# EAGLE design input module-v2 (EAGLE 9.6.2)
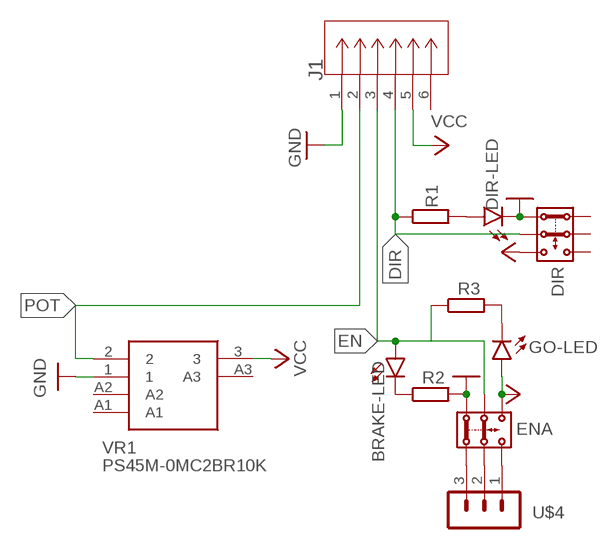
[diagram p0: schematic, sheet 1]

## Parts
BRAKE-LED  LED5MM  [LED5MM]
DIR  DPDT-PUSHBUTTON  [7MM*7MM]
DIR-LED  LED5MM  [LED5MM]
ENA  DPDT-PUSHBUTTON  [7MM*7MM]
GO-LED  LED5MM  [LED5MM]
J1  B6B-PH-K-S(LF)(SN)-JST  [CONN_B6B-PH-K-S_JST]
R1  R-EU_0207/10  [0207/10]
R2  R-EU_0207/10  [0207/10]
R3  R-EU_0207/10  [0207/10]
U$4  MALE-HEADER-3PIN  [MA03-1]
VR1  PS45M-0MC2BR10K  [PS45M0MC2BR10K]

## Nets
DIR: DIR.2 J1.4 R1.1
EN: BRAKE-LED.A ENA.5 J1.3 R3.1
GND: DIR-LED.K(C) DIR.1 ENA.6 J1.1 R2.2 VR1.1
N$4: DIR-LED.A R1.2
N$5: ENA.3 U$4.1
N$6: ENA.2 U$4.2
N$7: ENA.1 U$4.3
N$9: BRAKE-LED.K(C) R2.1
N$10: GO-LED.K(C) R3.2
POT: J1.2 VR1.2
VCC: DIR.3 ENA.4 GO-LED.A J1.5 VR1.3
Unconnected: DIR.4 DIR.5 DIR.6 J1.6 VR1.A1 VR1.A2 VR1.A3

## Library data of the parts
BRAKE-LED DIR-LED GO-LED = led:LED: LED OSRAM: - CHIPLED LG R971, LG N971, LY N971, LG Q971, LY Q971, LO R971, LY R971 LH N974, LH R974 LS Q976, LO Q976, LY Q976 LO Q996 - Hyper CHIPLED LW Q18S LB Q993, LB Q99A, LB R99A - SideLED LS A670, LO A670, LY A670, LG A670, LP A670 LB A673, LV A673, LT A673, LW A673 LH A674 LY A675 LS A676, LA A676, LO A676, LY A676, LW A676 LS A679, LY A679, LG A679 - Hyper Micro SIDELED® LS Y876, LA Y876, LO Y876, LY Y876 LT Y87S - SmartLED LW L88C, LW L88S LB L89C, LB L89S, LG L890 LS L89K, LO L89K, LY L89K LS L896, LA L896, LO L896, LY L896 - TOPLED LS T670, LO T670, LY T670, LG T670, LP T670 LSG T670, LSP T670, LSY T670, LOP T670, LYG T670 LG T671, LOG T671, LSG T671 LB T673, LV T673, LT T673, LW T673 LH T674 LS T676, LA T676, LO T676, LY T676, LB T676, LH T676, LSB T676, LW T676 LB T67C, LV T67C, LT T67C, LS T67K, LO T67K, LY T67K, LW E67C LS E67B, LA E67B, LO E67B, LY E67B, LB E67C, LV E67C, LT E67C LW T67C LS T679, LY T679, LG T679 LS T770, LO T770, LY T770, LG T770, LP T770 LB T773, LV T773, LT T773, LW T773 LH T774 LS E675, LA E675, LY E675, LS T675 LS T776, LA T776, LO T776, LY T776, LB T776 LHGB T686 LT T68C, LB T68C - Hyper Mini TOPLED® LB M676 - Mini TOPLED Santana® LG M470 LS M47K, LO M47K, LY M47K Source: http://www.osram.convergy.de LUXEON: - LUMILED® LXK2-PW12-R00, LXK2-PW12-S00, LXK2-PW14-U00, LXK2-PW14-V00 LXK2-PM12-R00, LXK2-PM12-S00, LXK2-PM14-U00 LXK2-PE12-Q00, LXK2-PE12-R00, LXK2-PE12-S00, LXK2-PE14-T00, LXK2-PE14-U00 LXK2-PB12-K00, LXK2-PB12-L00, LXK2-PB12-M00, LXK2-PB14-N00, LXK2-PB14-P00, LXK2-PB14-Q00 LXK2-PR12-L00, LXK2-PR12-M00, LXK2-PR14-Q00, LXK2-PR14-R00 LXK2-PD12-Q00, LXK2-PD12-R00, LXK2-PD12-S00 LXK2-PH12-R00, LXK2-PH12-S00 LXK2-PL12-P00, LXK2-PL12-Q00, LXK2-PL12-R00 Source: www.luxeon.com KINGBRIGHT: KA-3528ASYC Source: www.kingbright.com
DIR ENA = motorTestRig:DPDT-PUSHBUTTON: 7mm X 7mm DPDT pushbutton switch datasheet <https://cablesandconnectors.com/PIX/al374751p.jpg>
J1 = bidpl:B6B-PH-K-S(LF)(SN)-JST; BUILT_BY: EMA_Cory; COPYRIGHT: Copyright (C) 2018 Accelerated Designs. All rights reserved; DATASHEET: http://www.jst-mfg.com/product/pdf/eng/ePH.pdf; MANUFACTURER_PART_NUMBER: B6B-PH-K-S(LF)(SN); SOURCELIBRARY: Add_to_database_2020-12-08; VENDOR: JST
R1-R3 = resistor:R-EU_: RESISTOR, European symbol
U$4 = motorTestRig:MALE-HEADER-3PIN
VR1 = SamacSys_Parts:PS45M-0MC2BR10K: Slide Potentiometers 10K Ohms 20% SLIDE POTENTIOMETER Source: Datasheet <https://componentsearchengine.com/Datasheets/1/PS45M-0MC2BR10K.pdf>; DESCRIPTION: Slide Potentiometers 10K Ohms 20% SLIDE POTENTIOMETER; HEIGHT: 23mm; MANUFACTURER_NAME: BI Technologies; MANUFACTURER_PART_NUMBER: PS45M-0MC2BR10K; MOUSER_PART_NUMBER: 858-PS45M0MC2BR10K; MOUSER_PRICE-STOCK: https://www.mouser.com/Search/Refine.aspx?Keyword=858-PS45M0MC2BR10K

## Board
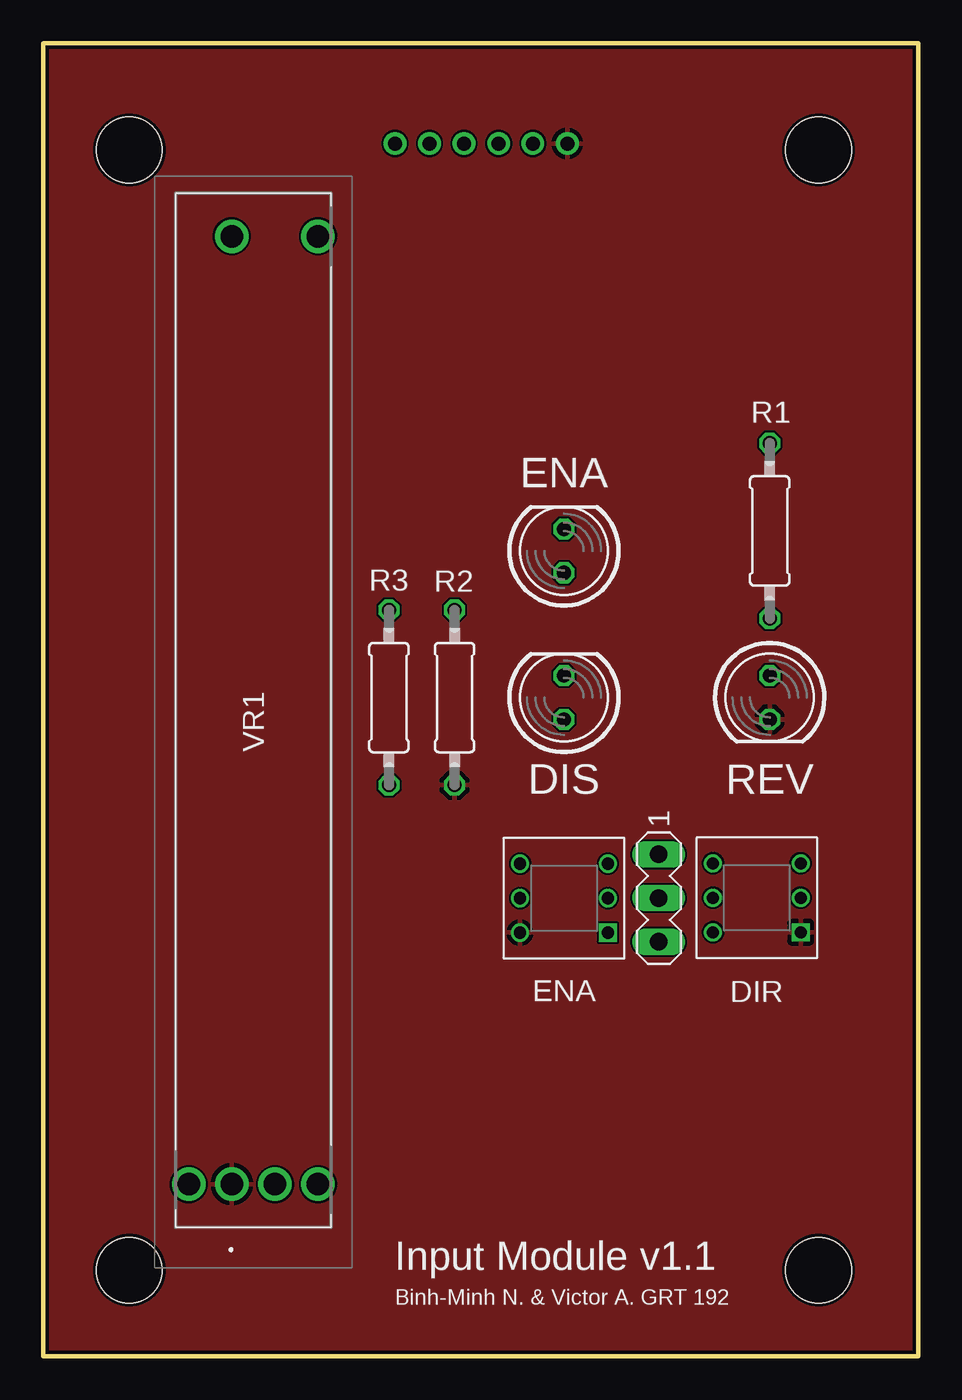
[diagram p1: board, top side]
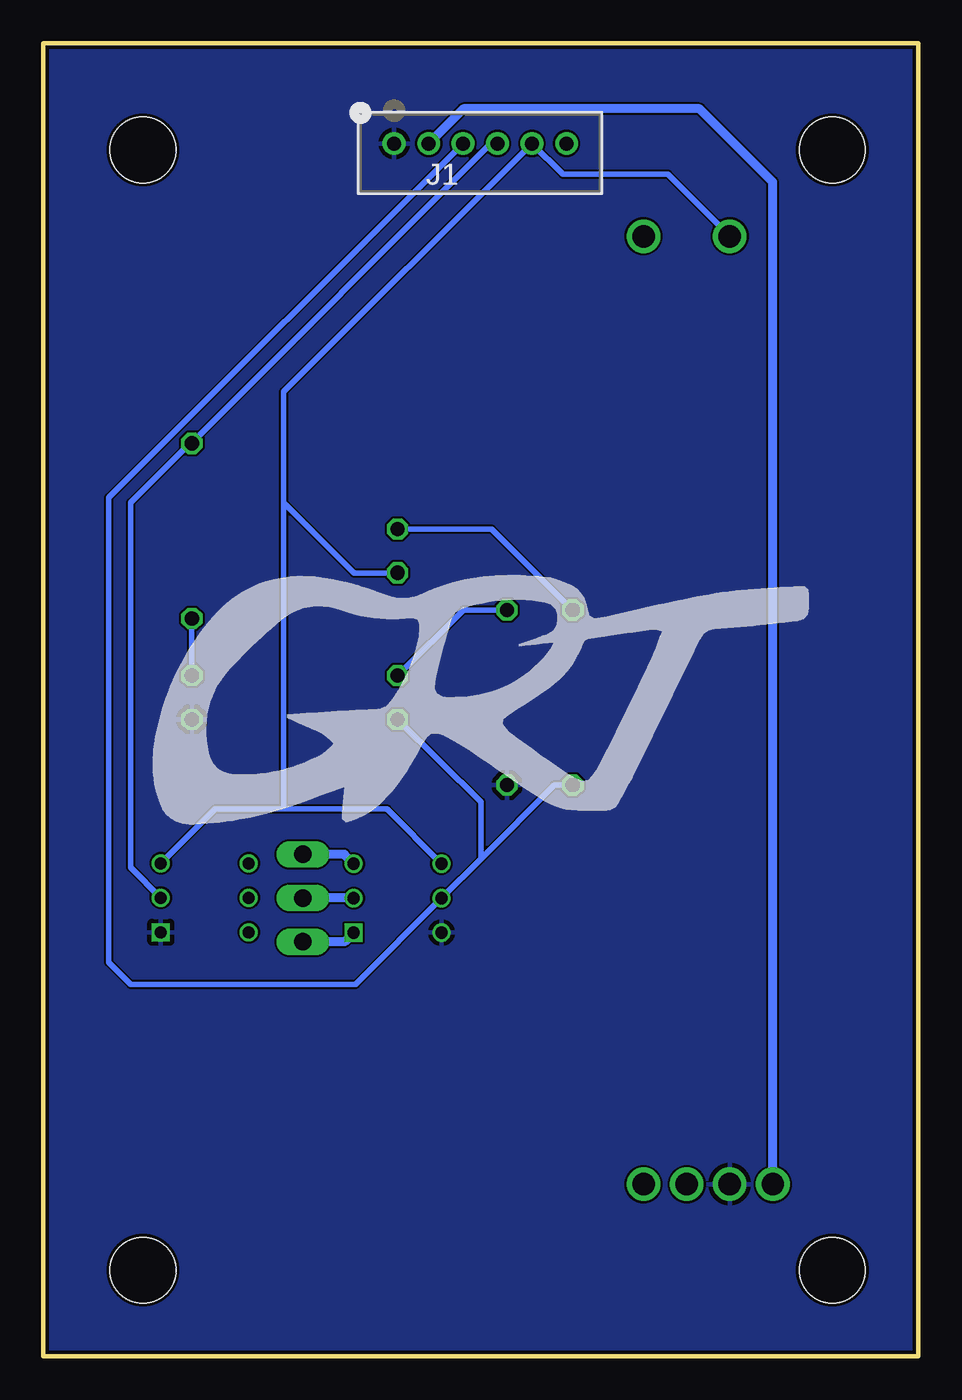
[diagram p2: board, bottom side, seen from below]

Size 50.8 x 76.2 mm. Coordinates in mm from the lower left corner, seen from the top.
Outline: 0,0 50.8,0 50.8,76.2 0,76.2 0,0
Copper layers (1*16): Top 0.035559375mm / dielectric 1.6mm / Bottom 0.035559375mm
Design rules "jlcpcb2layer": minimum track width 5mil, minimum drill 12mil, track to track 5mil, track to pad 5mil, pad to pad 5mil, via to via 5mil, smd to smd 5mil, copper to edge 8mil, drill to drill 6mil, minimum pad ring 5mil, minimum via ring 3mil, stop-mask expansion 2.5mil, vias tented up to drill 0mil, thermal gap 10mil
Holes 3.8 mm at 5,5 5,70 45,70 45,5

### Footprints (pad centres in the part's own frame; a part is rotated, then mirrored left to right if it is on the bottom)
LED5MM = drill 0.813 octagon: A -1.27,0; K 1.27,0
7MM*7MM = drill 0.7 square: 1 -2,-2.55 | drill 0.7: 2 0,-2.55; 3 2,-2.55; 4 2,2.55; 5 0,2.55; 6 -2,2.55
CONN_B6B-PH-K-S_JST = drill 0.813 pad 1.321: 1 -4.991,0; 2 -2.985,0; 3 -1.003,0; 4 1.003,0; 5 3.01,0; 6 5.016,0
0207/10 = drill 0.813 octagon: 1 -5.08,0; 2 5.08,0
MA03-1 = drill 1.016 long: 1 -2.54,0; 2 0,0; 3 2.54,0
PS45M0MC2BR10K = drill 1.3 pad 1.95: 1 0,0; 2 0,2.5; 3 55,0; A1 0,-5; A2 0,-2.5; A3 55,-5

### Placement (x,y rotation side)
BRAKE-LED  30.23,38.23 90 top
DIR  41.42,26.61 90 top
DIR-LED  42.16,38.23 270 top
ENA  30.23,26.59 90 top
GO-LED  30.23,46.74 90 top
J1  25.44,70.37 0 bottom
R1  42.16,47.9 270 top
R2  23.88,38.23 270 top
R3  20.07,38.23 90 top
U$4  35.73,26.6 270 top
VR1  10.95,9.99 90 top

### Tracks (layer width: path | path; a pad name or v marks a point on that pad's centre or on a via)
DIR
  Bottom 0.305: DIR.2 45.72,28.36 45.72,49.53 42.27,52.98 R1.1 24.83,70.38 J1.4
EN
  Bottom 0.305: 25.4,28.87 ENA.5 32.68,21.59 45.72,21.59 46.99,22.86 46.99,49.82 J1.3 | BRAKE-LED.A 25.4,32.16 25.4,28.87 | 25.4,28.87 21.12,33.15 R3.1
GND
  pour Bottom: -2,-1 101,-1 102,0 102,101 99,104 2,104 -4,98 -4,1
  pour Top: -1,82.7 -1,0 0,-1 53.44,-1 53.44,78.28 49.02,82.7
N$4
  Bottom 0.305: DIR-LED.A R1.2
N$5
  Bottom 0.508: ENA.3 33.33,29.14 U$4.1
N$6
  Bottom 0.508: ENA.2 U$4.2
N$7
  Bottom 0.508: ENA.1 33.31,24.06 U$4.3
N$9
  Bottom 0.305: R2.1 26.42,43.31 BRAKE-LED.K
N$10
  Bottom 0.305: R3.2 24.77,48.01 GO-LED.K
POT
  Bottom 0.508: VR1.2 8.45,68.14 12.7,72.39 26.41,72.39 J1.2
VCC
  Bottom 0.305: DIR.3 40.83,31.75 36.83,31.75 | ENA.4 30.84,31.75 36.83,31.75 | 36.83,49.53 36.83,55.97 J1.5 20.63,68.58 14.54,68.58 VR1.3 | 36.83,49.53 36.83,31.75 | GO-LED.A 32.77,45.47 36.83,49.53

### Text on the board
tPlace: ENA | DIS | REV | Input Module v1.1 | Binh-Minh N. & Victor A. GRT 192